# EAGLE design teensy_adapter (EAGLE 9.3.2)
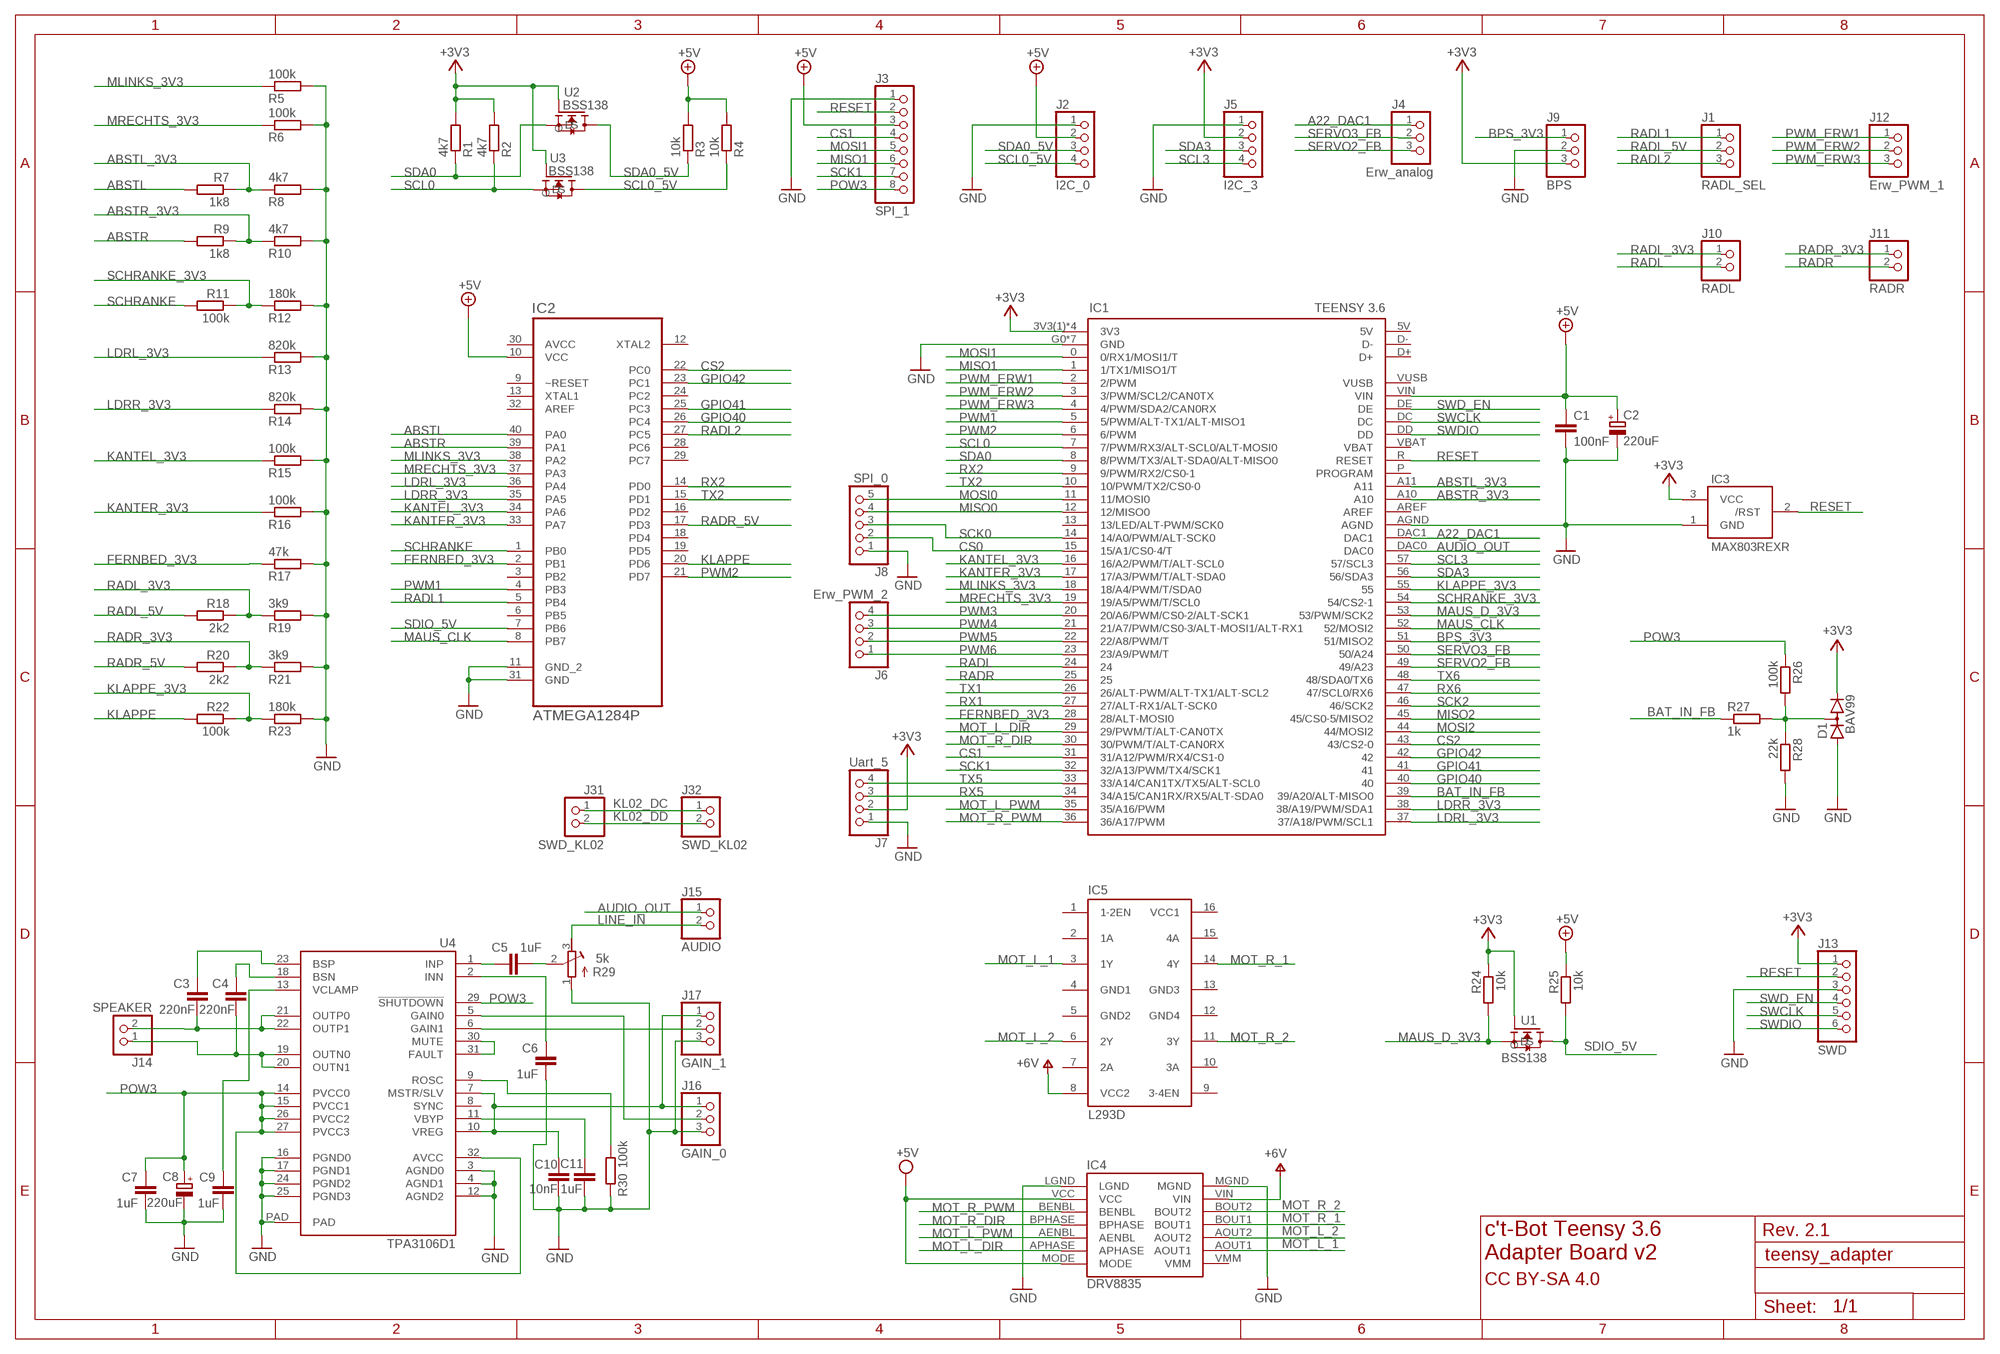
[diagram p0: schematic, sheet 1]

## Parts
C1  100nF  C-EU025-025X050  [C025-025X050]
C2  220uF  CPOL-EUE2.5-6  [E2,5-6]
C3  220nF  C-EU025-025X050  [C025-025X050]
C4  220nF  C-EU025-025X050  [C025-025X050]
C5  1uF  C-EU025-025X050  [C025-025X050]
C6  1uF  C-EU025-025X050  [C025-025X050]
C7  1uF  C-EU025-025X050  [C025-025X050]
C8  220uF  CPOL-EUE2.5-6  [E2,5-6]
C9  1uF  C-EU025-025X050  [C025-025X050]
C10  10nF  C-EU025-025X050  [C025-025X050]
C11  1uF  C-EU025-025X050  [C025-025X050]
D1  BAV99  BAV199  [SOT23]
IC1  TEENSY 3.6  TEENSY3_6--ALLPINS  [T36]
IC2  ATMEGA1284P  ATMEGA1284P-PU  [DIP254P1524X483-40]
IC3  MAX803REXR  [SC70-3L]
IC4  DRV8835  POLOLU_MOTOR_DRV8835THROUGHHOLE  [POLOLU_MOTOR_DRV_DRV8835]
IC5  L293D  [DIL16]
J1  RADL_SEL  PINHD-1X3  [1X03]
J2  I2C_0  PINHD-1X4  [1X04]
J3  SPI_1  PINHD-1X8  [1X08]
J4  Erw_analog  PINHD-1X3  [1X03]
J5  I2C_3  PINHD-1X4  [1X04]
J6  Erw_PWM_2  PINHD-1X4  [1X04]
J7  Uart_5  PINHD-1X4  [1X04]
J8  SPI_0  PINHD-1X5  [1X05]
J9  BPS  PINHD-1X3  [1X03]
J10  RADL  PINHD-1X2  [1X02]
J11  RADR  PINHD-1X2  [1X02]
J12  Erw_PWM_1  PINHD-1X3  [1X03]
J13  SWD  PINHD-1X6  [1X06]
J14  SPEAKER  PINHD-1X2  [1X02]
J15  AUDIO  PINHD-1X2  [1X02]
J16  GAIN_0  PINHD-1X3  [1X03]
J17  GAIN_1  PINHD-1X3  [1X03]
J31  SWD_KL02  PINHD-1X2  [1X02]
J32  SWD_KL02  PINHD-1X2/90  [1X02/90]
R1  4k7  R-EU_0204/2V  [0204V]
R2  4k7  R-EU_0204/2V  [0204V]
R3  10k  R-EU_0204/2V  [0204V]
R4  10k  R-EU_0204/2V  [0204V]
R5  100k  R-EU_0204/2V  [0204V]
R6  100k  R-EU_0204/2V  [0204V]
R7  1k8  R-EU_0204/2V  [0204V]
R8  4k7  R-EU_0204/2V  [0204V]
R9  1k8  R-EU_0204/2V  [0204V]
R10  4k7  R-EU_0204/2V  [0204V]
R11  100k  R-EU_0204/2V  [0204V]
R12  180k  R-EU_0204/2V  [0204V]
R13  820k  R-EU_0204/2V  [0204V]
R14  820k  R-EU_0204/2V  [0204V]
R15  100k  R-EU_0204/2V  [0204V]
R16  100k  R-EU_0204/2V  [0204V]
R17  47k  R-EU_0204/2V  [0204V]
R18  2k2  R-EU_0204/2V  [0204V]
R19  3k9  R-EU_0204/2V  [0204V]
R20  2k2  R-EU_0204/2V  [0204V]
R21  3k9  R-EU_0204/2V  [0204V]
R22  100k  R-EU_0204/2V  [0204V]
R23  180k  R-EU_0204/2V  [0204V]
R24  10k  R-EU_0204/2V  [0204V]
R25  10k  R-EU_0204/2V  [0204V]
R26  100k  R-EU_0204/2V  [0204V]
R27  1k  R-EU_0204/2V  [0204V]
R28  22k  R-EU_0204/2V  [0204V]
R29  5k  R-TRIMM64W  [RTRIM64W]
R30  100k  R-EU_0204/2V  [0204V]
U1  BSS138  [BSS138]
U2  BSS138  [BSS138]
U3  BSS138  [BSS138]
U4  TPA3106D1  [HTQFP32]

## Nets
+3V3: D1.2(C) IC1.3V3(1)(3V3) IC1.3V3(2)(3V3) IC1.3V3(3)(3V3) IC1.3V3(4)(3V3) IC3.3(VCC) J5.2 J7.2 J9.3 J13.1 R1.2 R2.2 R24.1 U1.G U2.G U3.G
+5V: C1.1 C2.+ IC1.VIN IC2.10(VCC) IC4.MODE IC4.VCC J2.2 J3.3 R3.2 R4.2 R25.1
+6V: IC4.VIN IC5.8(VCC2)
A22_DAC1: IC1.DAC1 J4.1
ABSTL: IC2.40(PA0) R7.2
ABSTL_3V3: IC1.A11 R7.1 R8.1
ABSTR: IC2.39(PA1) R9.2
ABSTR_3V3: IC1.A10 R9.1 R10.1
AUDIO_OUT: IC1.DAC0 J15.1
BAT_IN_FB: IC1.39(39/A20/ALT-MISO0) R27.1
BPS_3V3: IC1.51(51/MISO2) J9.1
BSN: C4.1 U4.18(BSN)
BSP: C3.1 U4.23(BSP)
CS0: IC1.15(15/A1/CS0-4/T) J8.2
CS1: IC1.31(31/A12/PWM/RX4/CS1-0) J3.4
CS2: IC1.43(43/CS2-0) IC2.22(PC0)
FERNBED_3V3: IC1.28(28/ALT-MOSI0) IC2.2(PB1) R17.1
GAIN0: J16.2 U4.5(GAIN0)
GAIN1: J17.2 U4.6(GAIN1)
GND: C1.2 C2.- C6.2 C7.2 C8.- C9.2 C10.2 C11.2 D1.1(A) IC1.AGND IC1.G0(GND) IC1.G1(GND) IC1.G2(GND) IC1.G3(GND) IC1.G4(GND) IC1.G5(GND) IC1.G6(GND) IC2.11(GND_2) IC2.31(GND) IC3.1(GND) IC4.LGND IC4.MGND J2.1 J3.1 J5.1 J7.1 J8.1 J9.2 J13.3 J16.3 J17.3 R5.2 R6.2 R8.2 R10.2 R12.2 R13.2 R14.2 R15.2 R16.2 R17.2 R19.2 R21.2 R23.2 R28.2 R29.1(E) R30.1 U4.3(AGND0) U4.4(AGND1) U4.12(AGND2) U4.16(PGND0) U4.17(PGND1) U4.24(PGND2) U4.25(PGND3) U4.PAD
GPIO40: IC1.40 IC2.26(PC4)
GPIO41: IC1.41 IC2.25(PC3)
GPIO42: IC1.42 IC2.23(PC1)
INN: C6.1 U4.2(INN)
INP: C5.1 U4.1(INP)
KANTEL_3V3: IC1.16(16/A2/PWM/T/ALT-SCL0) IC2.34(PA6) R15.1
KANTER_3V3: IC1.17(17/A3/PWM/T/ALT-SDA0) IC2.33(PA7) R16.1
KL02_DC: J31.1 J32.1
KL02_DD: J31.2 J32.2
KLAPPE: IC2.20(PD6) R22.2
KLAPPE_3V3: IC1.55 R22.1 R23.1
LDRL_3V3: IC1.37(37/A18/PWM/SCL1) IC2.36(PA4) R13.1
LDRR_3V3: IC1.38(38/A19/PWM/SDA1) IC2.35(PA5) R14.1
LINE_IN: J15.2 R29.3(A)
MAUS_CLK: IC1.52(52/MOSI2) IC2.8(PB7)
MAUS_D_3V3: IC1.53(53/PWM/SCK2) R24.2 U1.S
MISO0: IC1.12(12/MISO0) J8.4
MISO1: IC1.1(1/TX1/MISO1/T) J3.6
MISO2: IC1.45(45/CS0-5/MISO2)
MLINKS_3V3: IC1.18(18/A4/PWM/T/SDA0) IC2.38(PA2) R5.1
MOSI0: IC1.11(11/MOSI0) J8.5
MOSI1: IC1.0(0/RX1/MOSI1/T) J3.5
MOSI2: IC1.44(44/MOSI2)
MOT_L_1: IC4.AOUT1 IC5.3(1Y)
MOT_L_2: IC4.AOUT2 IC5.6(2Y)
MOT_L_DIR: IC1.29(29/PWM/T/ALT-CAN0TX) IC4.APHASE
MOT_L_PWM: IC1.35(35/A16/PWM) IC4.AENBL
MOT_R_1: IC4.BOUT1 IC5.14(4Y)
MOT_R_2: IC4.BOUT2 IC5.11(3Y)
MOT_R_DIR: IC1.30(30/PWM/T/ALT-CAN0RX) IC4.BPHASE
MOT_R_PWM: IC1.36(36/A17/PWM) IC4.BENBL
MRECHTS_3V3: IC1.19(19/A5/PWM/T/SCL0) IC2.37(PA3) R6.1
N$4: D1.3(AC) R26.2 R27.2 R28.1
N$90: U4.30(MUTE) U4.31(FAULT)
N$163: C5.2 R29.2(S)
OUTN: C4.2 J14.1 U4.19(OUTN0) U4.20(OUTN1)
OUTP: C3.2 J14.2 U4.21(OUTP0) U4.22(OUTP1)
POW3: C7.1 C8.+ J3.8 R26.1 U4.14(PVCC0) U4.15(PVCC1) U4.26(PVCC2) U4.27(PVCC3) U4.29(!SHUTDOWN) U4.32(AVCC)
PWM1: IC1.5(5/PWM/ALT-TX1/ALT-MISO1) IC2.4(PB3)
PWM2: IC1.6(6/PWM) IC2.21(PD7)
PWM3: IC1.20(20/A6/PWM/CS0-2/ALT-SCK1) J6.4
PWM4: IC1.21(21/A7/PWM/CS0-3/ALT-MOSI1/ALT-RX1) J6.3
PWM5: IC1.22(22/A8/PWM/T) J6.2
PWM6: IC1.23(23/A9/PWM/T) J6.1
PWM_ERW1: IC1.2(2/PWM) J12.1
PWM_ERW2: IC1.3(3/PWM/SCL2/CAN0TX) J12.2
PWM_ERW3: IC1.4(4/PWM/SDA2/CAN0RX) J12.3
RADL: IC1.24 J10.2
RADL1: IC2.5(PB4) J1.1
RADL2: IC2.27(PC5) J1.3
RADL_3V3: J10.1 R18.1 R19.1
RADL_5V: J1.2 R18.2
RADR: IC1.25 J11.2
RADR_3V3: J11.1 R20.1 R21.1
RADR_5V: IC2.17(PD3) R20.2
RESET: IC1.R(RESET) IC3.2(/RST) J3.2 J13.2
ROSC: R30.2 U4.9(ROSC)
RX1: IC1.27(27/ALT-RX1/ALT-SCK0)
RX2: IC1.9(9/PWM/RX2/CS0-1) IC2.14(PD0)
RX5: IC1.34(34/A15/CAN1RX/RX5/ALT-SDA0) J7.3
RX6: IC1.47(47/SCL0/RX6)
SCHRANKE: IC2.1(PB0) R11.2
SCHRANKE_3V3: IC1.54(54/CS2-1) R11.1 R12.1
SCK0: IC1.14(14/A0/PWM/ALT-SCK0) J8.3
SCK1: IC1.32(32/A13/PWM/TX4/SCK1) J3.7
SCK2: IC1.46(46/SCK2)
SCL0: IC1.7(7/PWM/RX3/ALT-SCL0/ALT-MOSI0) R2.1 U3.S
SCL0_5V: J2.4 R4.1 U3.D
SCL3: IC1.57(57/SCL3) J5.4
SDA0: IC1.8(8/PWM/TX3/ALT-SDA0/ALT-MISO0) R1.1 U2.S
SDA0_5V: J2.3 R3.1 U2.D
SDA3: IC1.56(56/SDA3) J5.3
SDIO_5V: IC2.7(PB6) R25.2 U1.D
SERVO2_FB: IC1.49(49/A23) J4.3
SERVO3_FB: IC1.50(50/A24) J4.2
SWCLK: IC1.DC J13.5
SWD_EN: IC1.DE J13.4
SWDIO: IC1.DD J13.6
TX1: IC1.26(26/ALT-PWM/ALT-TX1/ALT-SCL2)
TX2: IC1.10(10/PWM/TX2/CS0-0) IC2.15(PD1)
TX5: IC1.33(33/A14/CAN1TX/TX5/ALT-SCL0) J7.4
TX6: IC1.48(48/SDA0/TX6)
VBYP: C11.1 U4.11(VBYP)
VCLAMP: C9.1 U4.13(VCLAMP)
VREG: C10.1 J16.1 J17.1 U4.7(MSTR/SLV) U4.10(VREG)
Unconnected: IC1.5V IC1.13(13/LED/ALT-PWM/SCK0) IC1.AREF IC1.D+ IC1.D- IC1.P(PROGRAM) IC1.VBAT IC1.VUSB IC2.3(PB2) IC2.6(PB5) IC2.9(~RESET) IC2.12(XTAL2) IC2.13(XTAL1) IC2.16(PD2) IC2.18(PD4) IC2.19(PD5) IC2.24(PC2) IC2.28(PC6) IC2.29(PC7) IC2.32(AREF) IC4.VMM IC5.1(1-2EN) IC5.2(1A) IC5.7(2A) IC5.9(3-4EN) IC5.10(3A) IC5.15(4A) U4.8(SYNC)

## Notes on the sheet
- Rev. 2.1
- c't-Bot Teensy 3.6 
  Adapter Board v2
- CC BY-SA 4.0

## Power pins joined to a net without a drawn wire
AVCC: IC2.30(AVCC)
GND1: IC5.4(GND1)
GND2: IC5.5(GND2)
GND3: IC5.13(GND3)
GND4: IC5.12(GND4)
VCC1: IC5.16(VCC1)

## Library data of the parts
C1 = rcl:C-EU: CAPACITOR, European symbol; SPICEPREFIX: C
C2 = rcl:CPOL-EU: POLARIZED CAPACITOR, European symbol; SPICEPREFIX: C
C3-C7 C9-C11 = rcl:C-EU: CAPACITOR, European symbol
C8 = rcl:CPOL-EU: POLARIZED CAPACITOR, European symbol
D1 = diode:BAV199: DIODE low-leakage double diode
IC1 = Teensy_3_6:TEENSY3_6--ALLPINS
IC2 = Atmel_By_element14_Batch_1:ATMEGA1284P-PU: 8-bit Microcontroller with In-System Programmable Flash; MPN: ATMEGA1284P-PU; OC_FARNELL: 1715481; OC_NEWARK: 15R0264; PACKAGE: PDIP-40; SUPPLIER: Atmel
IC3 = maxim-10:MAX803*: 3-Pin Microprocessor Reset Circuit
IC4 = pololu:POLOLU_MOTOR_DRV8835
IC5 = st-microelectronics:L293D: PUSH-PULL 4 CHANNEL DRIVER; MPN: L293D; OC_FARNELL: 9589619; OC_NEWARK: 56P8249
J1 J4 J9 J12 J16 J17 = pinhead_ts:PINHD-1X3: PIN HEADER
J2 J5-J7 = pinhead_ts:PINHD-1X4: PIN HEADER
J3 = pinhead_ts:PINHD-1X8: PIN HEADER
J8 = pinhead_ts:PINHD-1X5: PIN HEADER
J10 J11 J14 J15 J31 J32 = pinhead_ts:PINHD-1X2: PIN HEADER
J13 = pinhead_ts:PINHD-1X6: PIN HEADER
R1-R28 = rcl:R-EU_: RESISTOR, European symbol; SPICEPREFIX: R
R29 = rcl:R-TRIMM: Trimm resistor
R30 = rcl:R-EU_: RESISTOR, European symbol
U1-U3 = Ava:BSS138: BSS138 N-Channel Logic Level Enhancement Mode Field Effect Transistor
U4 = user:TPA3106D1

## Net classes
0 default: width 0.203 mm

## Board
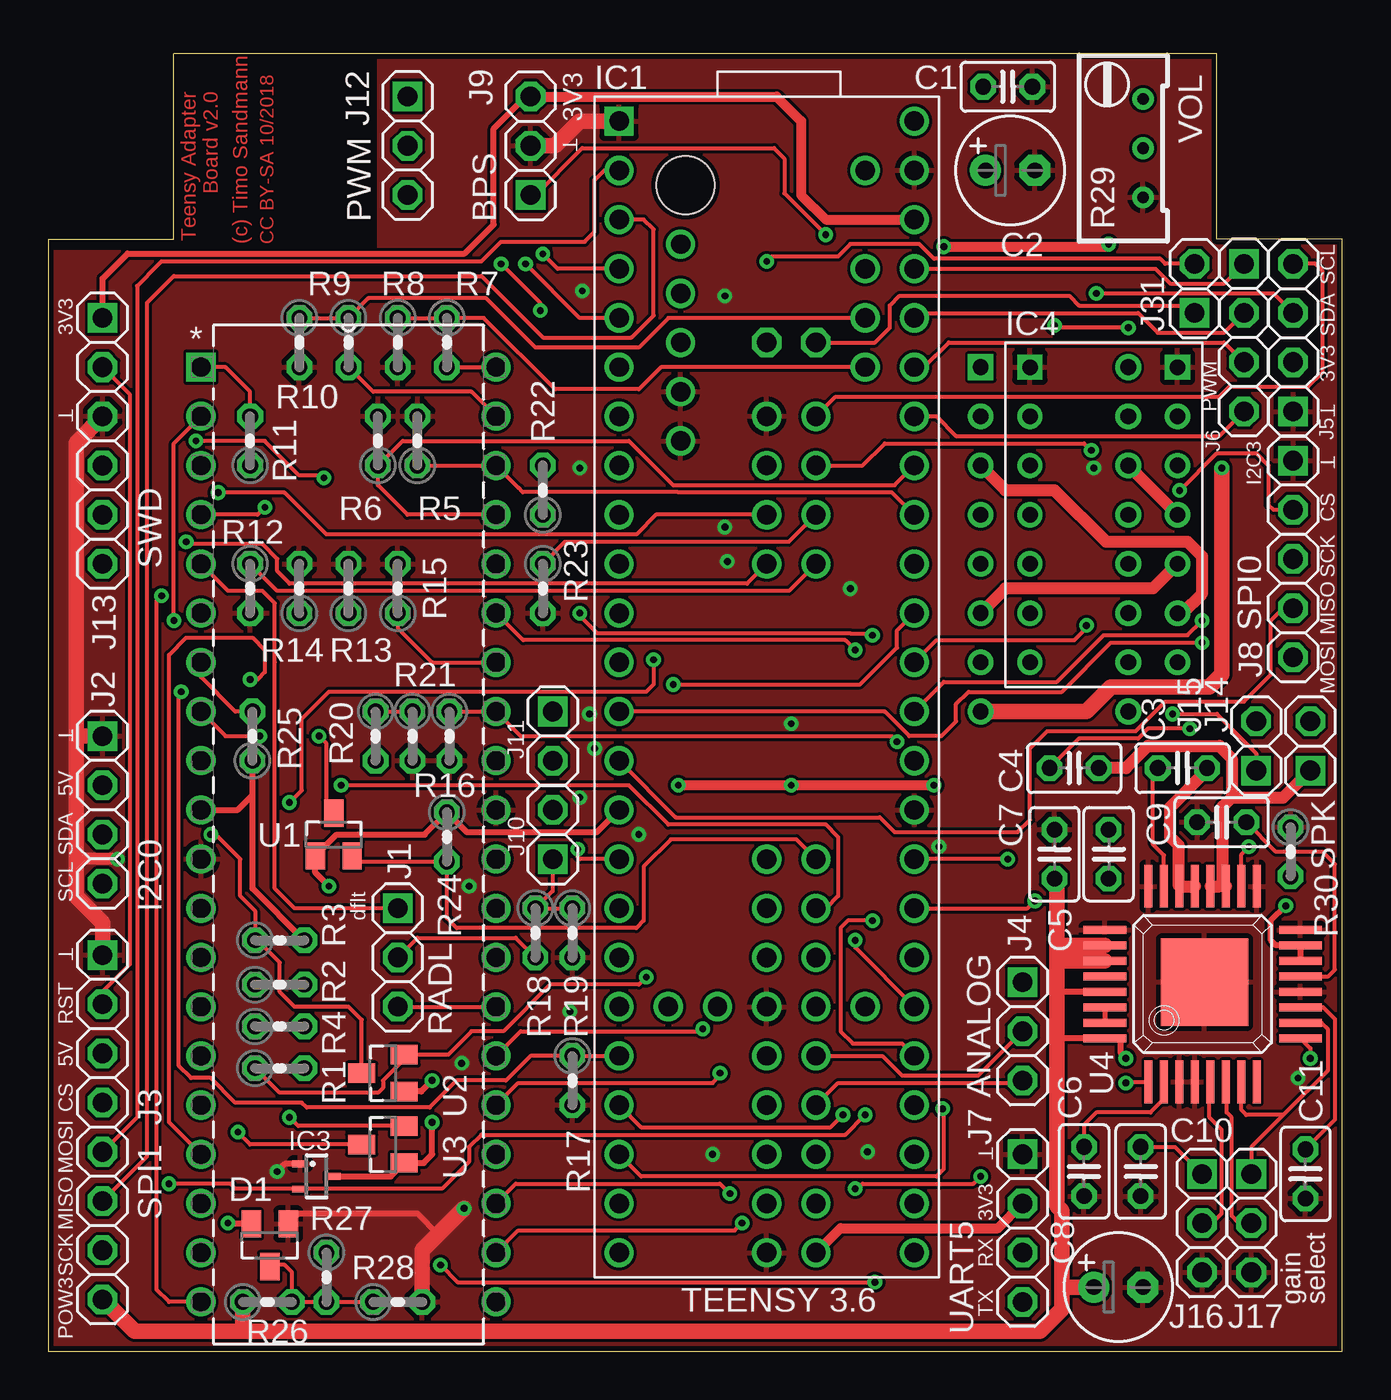
[diagram p1: board, top side]
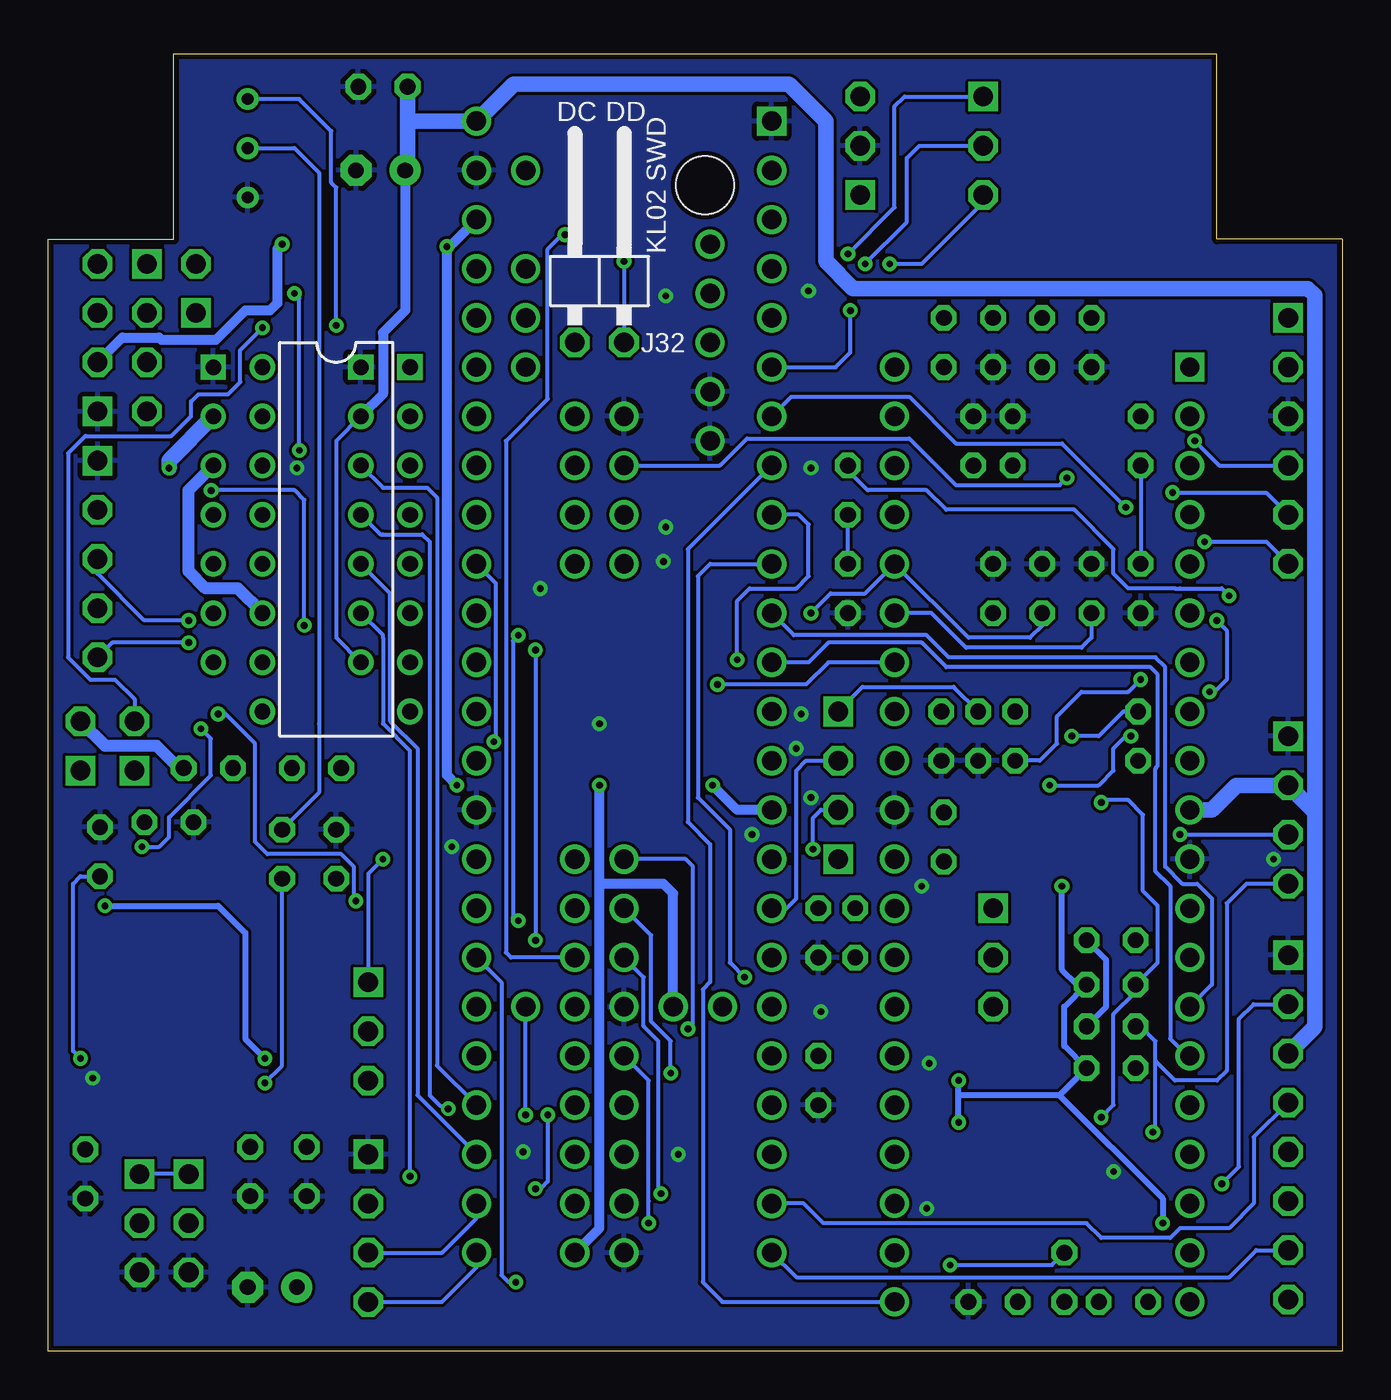
[diagram p2: board, bottom side, seen from below]

Size 66.8 x 66.98 mm. Coordinates in mm from the lower left corner, seen from the top.
Outline: 0,0 66.8,0 66.8,57.4 60.33,57.4 60.33,66.98 6.48,66.98 6.48,57.4 0,57.4 0,0
Copper layers (1*16): Top 0.035mm / dielectric 1.5mm / Bottom 0.035mm
Design rules "jlcpcb_2layer_DRU": minimum track width 6mil, minimum drill 0.3mm, track to track 6mil, track to pad 6mil, pad to pad 6mil, via to via 6mil, smd to smd 6mil, copper to edge 10mil, drill to drill 6mil, minimum pad ring 10mil, minimum via ring 8mil, stop-mask expansion 4mil, vias tented up to drill 0mil, thermal gap 10mil
Holes 3 mm at 32.89,60.2

### Footprints (pad centres in the part's own frame; a part is rotated, then mirrored left to right if it is on the bottom)
C025-025X050 = drill 0.813 octagon: 1 -1.27,0; 2 1.27,0
E2,5-6 = drill 0.813 pad 1.6: + -1.27,0 | drill 0.813 pad 1.6 octagon: - 1.27,0
SOT23 = smd 1 x 1.4: 1 -0.95,-1.1; 2 0.95,-1.1; 3 0,1.1
T36 = drill 1: 0 -26.67,-7.62; 1 -24.13,-7.62; 2 -21.59,-7.62; 3 -19.05,-7.62; 3V3(1) 6.35,-7.62; 3V3(2) 16.51,-2.54; 3V3(3) -24.13,7.62; 3V3(4) 29.21,2.54; 4 -16.51,-7.62; 5 -13.97,-7.62; 5V -22.86,-4.445; 6 -11.43,-7.62; 7 -8.89,-7.62; 8 -6.35,-7.62; 9 -3.81,-7.62; 10 -1.27,-7.62; 11 1.27,-7.62; 12 3.81,-7.62; 13 3.81,7.62; 14 1.27,7.62; 15 -1.27,7.62; 16 -3.81,7.62; 17 -6.35,7.62; 18 -8.89,7.62; 19 -11.43,7.62; 20 -13.97,7.62; 21 -16.51,7.62; 22 -19.05,7.62; 23 -21.59,7.62; 24 8.89,-7.62; 25 11.43,-7.62; 26 13.97,-7.62; 27 16.51,-7.62; 28 19.05,-7.62; 29 21.59,-7.62; 30 24.13,-7.62; 31 26.67,-7.62; 32 29.21,-7.62; 33 29.21,7.62; 34 26.67,7.62; 35 24.13,7.62; 36 21.59,7.62; 37 19.05,7.62; 38 16.51,7.62; 39 13.97,7.62; 40 8.89,0; 41 11.43,0; 42 13.97,0; 43 19.05,0; 44 21.59,0; 45 24.13,0; 46 26.67,0; 47 26.67,2.54; 48 24.13,2.54; 49 21.59,2.54; 50 19.05,2.54; 51 13.97,2.54; 52 11.43,2.54; 53 8.89,2.54; 54 -6.35,2.54; 55 -8.89,2.54; 56 -11.43,2.54; 57 -13.97,2.54; A10 -19.05,5.08; A11 -16.51,5.08; AGND -26.67,7.62; AREF -21.59,5.08; D+ -17.78,-4.445; D- -20.32,-4.445; DAC0 11.43,7.62; DAC1 8.89,7.62; DC -8.89,0; DD -6.35,0; DE -11.43,0; G1 16.51,0; G2 6.35,7.62; G3 29.21,0; G4 -15.24,-4.445; G5 -12.7,-4.445; G6 -13.97,0; P 16.51,2.54; R 16.51,5.08; VBAT 16.51,-5.08; VIN -29.21,7.62; VUSB -26.67,5.08 | drill 1 square: G0 -29.21,-7.62
DIP254P1524X483-40 = drill 0.991 square: 1 -15.24,48.26 | drill 0.991: 2 -15.24,45.72; 3 -15.24,43.18; 4 -15.24,40.64; 5 -15.24,38.1; 6 -15.24,35.56; 7 -15.24,33.02; 8 -15.24,30.48; 9 -15.24,27.94; 10 -15.24,25.4; 11 -15.24,22.86; 12 -15.24,20.32; 13 -15.24,17.78; 14 -15.24,15.24; 15 -15.24,12.7; 16 -15.24,10.16; 17 -15.24,7.62; 18 -15.24,5.08; 19 -15.24,2.54; 20 -15.24,0; 21 0,0; 22 0,2.54; 23 0,5.08; 24 0,7.62; 25 0,10.16; 26 0,12.7; 27 0,15.24; 28 0,17.78; 29 0,20.32; 30 0,22.86; 31 0,25.4; 32 0,27.94; 33 0,30.48; 34 0,33.02; 35 0,35.56; 36 0,38.1; 37 0,40.64; 38 0,43.18; 39 0,45.72; 40 0,48.26
SC70-3L = smd 0.35 x 0.8: 1 -0.65,-0.85; 2 0.65,-0.85; 3 0,0.85
POLOLU_MOTOR_DRV_DRV8835 = drill 0.8: AENBL 1.27,6.35; AOUT1 8.89,3.81; AOUT2 8.89,6.35; APHASE 1.27,3.81; BENBL 1.27,11.43; BOUT1 8.89,8.89; BOUT2 8.89,11.43; BPHASE 1.27,8.89; MODE 1.27,1.27; VCC 1.27,13.97; VIN 8.89,13.97; VMM 8.89,1.27 | drill 0.8 square: LGND 1.27,16.51; MGND 8.89,16.51
DIL16 = drill 0.813 square: 1 -8.89,-3.81 | drill 0.813: 2 -6.35,-3.81; 3 -3.81,-3.81; 4 -1.27,-3.81; 5 1.27,-3.81; 6 3.81,-3.81; 7 6.35,-3.81; 8 8.89,-3.81; 9 8.89,3.81; 10 6.35,3.81; 11 3.81,3.81; 12 1.27,3.81; 13 -1.27,3.81; 14 -3.81,3.81; 15 -6.35,3.81; 16 -8.89,3.81
1X03 = drill 1.016 square: 1 -2.54,0 | drill 1.016 octagon: 2 0,0; 3 2.54,0
1X04 = drill 1.016 square: 1 -3.81,0 | drill 1.016 octagon: 2 -1.27,0; 3 1.27,0; 4 3.81,0
1X08 = drill 1.016 square: 1 -8.89,0 | drill 1.016 octagon: 2 -6.35,0; 3 -3.81,0; 4 -1.27,0; 5 1.27,0; 6 3.81,0; 7 6.35,0; 8 8.89,0
1X05 = drill 1.016 square: 1 -5.08,0 | drill 1.016 octagon: 2 -2.54,0; 3 0,0; 4 2.54,0; 5 5.08,0
1X02 = drill 1.016 square: 1 -1.27,0 | drill 1.016 octagon: 2 1.27,0
1X06 = drill 1.016 square: 1 -6.35,0 | drill 1.016 octagon: 2 -3.81,0; 3 -1.27,0; 4 1.27,0; 5 3.81,0; 6 6.35,0
1X02/90 = drill 1.016 octagon: 1 -1.27,-3.81; 2 1.27,-3.81
0204V = drill 0.813 octagon: 1 -1.27,0; 2 1.27,0
RTRIM64W = drill 0.61: 1 1.27,-2.54; 2 1.27,0; 3 1.27,2.54
BSS138 = smd 1 x 1.4: D 0,1.1; G -0.95,-1.1; S 0.95,-1.1
HTQFP32 = smd 0.4 x 2.2: 1 -2.9,-5.15; 2 -2.1,-5.15; 3 -1.3,-5.15; 4 -0.5,-5.15; 5 0.3,-5.15; 6 1.1,-5.15; 7 1.9,-5.15; 8 2.7,-5.15; 17 2.7,4.95; 18 1.9,4.95; 19 1.1,4.95; 20 0.3,4.95; 21 -0.5,4.95; 22 -1.3,4.95; 23 -2.1,4.95; 24 -2.9,4.95 | smd 2.2 x 0.4: 9 4.95,-2.9; 10 4.95,-2.1; 11 4.95,-1.3; 12 4.95,-0.5; 13 4.95,0.3; 14 4.95,1.1; 15 4.95,1.9; 16 4.95,2.7; 25 -5.15,2.7; 26 -5.15,1.9; 27 -5.15,1.1; 28 -5.15,0.3; 29 -5.15,-0.5; 30 -5.15,-1.3; 31 -5.15,-2.1; 32 -5.15,-2.9 | smd 4.5 x 4.5: PAD 0,0

### Placement (x,y rotation side)
C1  49.53,65.28 0 top
C2  49.66,60.96 0 top
C3  220n  [C025-025X050]  58.55,30.1 0 top
C4  220n  [C025-025X050]  52.96,30.1 0 top
C5  1u  [C025-025X050]  54.74,25.65 90 top
C6  1u  [C025-025X050]  53.47,9.27 270 top
C7  1u  [C025-025X050]  51.94,25.65 90 top
C8  220u  [E2,5-6]  55.24,3.3 0 top
C9  1u  [C025-025X050]  60.58,27.3 180 top
C10  10n  [C025-025X050]  56.39,9.27 270 top
C11  1u  [C025-025X050]  64.9,9.14 270 top
D1  11.43,5.46 180 top
IC1  37.08,34.29 270 top
IC2  23.11,2.54 0 top
IC3  13.84,9.02 270 top
IC4  49.4,34.29 0 top
IC5  51.94,41.91 270 top
J1  RADL  [1X03]  18.03,20.32 270 top
J2  2.79,27.94 270 top
J3  2.79,11.56 270 top
J4  50.29,16.51 270 top
J5  64.26,52.32 90 top
J6  61.72,52.32 270 top
J7  50.29,6.35 270 top
J8  64.26,40.89 270 top
J9  24.89,62.23 90 top
J10  26.04,26.67 90 top
J11  26.04,31.75 270 top
J12  18.54,62.23 270 top
J13  2.79,46.99 270 top
J14  65.15,31.24 90 top
J15  62.36,31.24 90 top
J16  59.56,6.6 270 top
J17  62.1,6.6 270 top
J31  59.18,54.86 90 top
J32  38.35,55.88 0 bottom
R1  11.94,14.61 0 top
R2  11.94,18.92 0 top
R3  11.94,21.21 0 top
R4  11.94,16.76 0 top
R5  19.05,46.99 90 top
R6  17.02,46.99 90 top
R7  20.57,52.07 270 top
R8  18.03,52.07 270 top
R9  15.49,52.07 270 top
R10  12.95,52.07 270 top
R11  10.41,46.99 90 top
R12  10.41,39.37 270 top
R13  15.49,39.37 90 top
R14  12.95,39.37 90 top
R15  18.03,39.37 90 top
R16  20.7,31.75 270 top
R17  27.05,13.97 270 top
R18  25.15,21.59 270 top
R19  27.05,21.59 270 top
R20  16.89,31.75 270 top
R21  18.8,31.75 270 top
R22  25.53,44.45 90 top
R23  25.53,39.37 270 top
R24  20.57,26.54 270 top
R25  10.54,31.75 90 top
R26  11.3,2.54 0 top
R27  14.35,3.81 270 top
R28  18.03,2.54 0 top
R29  5K  [RTRIM64W]  55.24,62.1 0 top
R30  100K  [0204V]  64.14,25.78 270 top
U1  14.73,26.67 0 top
U2  17.27,14.35 90 top
U3  17.27,10.67 90 top
U4  59.69,19.05 0 top

### Tracks (layer width: path | path; a pad name or v marks a point on that pad's centre or on a via)
+3V3  (via drill 0.35)
  Top 0.305: IC1.3V3(1) 28.32,26.8 21.59,26.8 R24.1 19.43,26.67 14.88,26.67 U1.G 13.78,24.7 v14.48,24 | v19.81,11.81 19.81,10.16 19.37,9.72 U3.G 17.67,9.02 IC3.3 | v19.81,13.97 19.24,13.4 U2.G | D1.2 9.31,6.56 v9.27,6.6 | J13.1 2.79,55.37 4.09,56.67 21.49,56.67 22.99,58.17 22.99,63.12 24.64,64.77 J9.3
  Top 0.508: J9.3 37.59,64.77 38.86,63.5 38.86,59.69 40.13,58.42 IC1.3V3(3) | v46.23,57.02 54.61,57.02 v54.74,57.15 | IC1.3V3(4) 40.89,6.35 49.02,6.35 J7.2 | v45.72,29.21 v38.35,29.21 v32.51,29.21
  Bottom 0.305: v14.48,24 14.48,19.68 13.72,18.92 R2.2 14.35,17.78 14.35,15.75 R1.2 14.61,13.21 | v19.81,11.81 19.81,13.21 | 19.81,13.21 v19.81,13.97 | 14.61,13.21 19.81,13.21 | v9.27,6.6 9.27,7.87 14.61,13.21
  Bottom 0.508: IC1.3V3(1) 31.24,27.94 v32.51,29.21 | IC1.3V3(4) 38.35,6.35 38.35,24.13 | IC1.3V3(2) 34.54,23.62 35.05,24.13 38.35,24.13 | v45.72,29.21 46.23,29.72 46.23,56.9 46.1,57.02 | 46.1,57.02 IC1.3V3(3) | v46.23,57.02 46.1,57.02 | 38.35,24.13 v38.35,29.21 | v54.74,57.15 54.99,56.9 54.99,54.1 55.37,53.72 56.64,53.72 58.17,52.2 60.96,52.2 61.09,52.32 62.99,52.32 J5.2
+5V
  Top 0.305: IC2.10 9.78,27.94 10.54,28.7 | 10.54,28.7 R25.1 | R3.2 10.54,23.88 10.54,28.7
  Bottom 0.203: IC4.VCC 51.94,46.99 51.94,36.83 IC4.MODE
  Bottom 0.305: R4.2 12.19,17.78 12.19,20.19 R3.2
  Bottom 0.508: C2.+ 48.39,53.72 49.53,52.58 49.53,49.4 IC4.VCC
  Bottom 0.813: IC2.10 6.73,27.94 5.46,29.21 J2.2 1.42,27.84 | 48.26,63.5 IC1.VIN 42.8,65.41 28.57,65.41 26.67,63.5 26.67,56.26 25.27,54.86 1.78,54.86 1.42,54.51 1.42,27.84 | C2.+ 48.26,61.09 48.26,63.5 | 48.26,63.5 C1.1 | J3.3 1.42,16.74 1.42,27.84
+6V  (via drill 0.35)
  Top 0.813: IC5.8 53.59,33.02 54.86,34.29 59.94,34.29 60.58,34.92 v60.58,45.59
  Bottom 0.813: IC4.VIN 60.58,45.97 v60.58,45.59
A22_DAC1  (via drill 0.35)
  Top 0.203: v49.53,25.4 IC1.DAC1
  Bottom 0.203: v49.53,25.4 50.29,24.64 J4.1
ABSTL
  Top 0.203: R7.2 IC2.40
ABSTL_3V3
  Top 0.203: R8.1 R7.1 22.48,53.34 26.16,49.66 30.48,49.66 31.62,50.8 IC1.A11
ABSTR
  Top 0.203: IC2.39 21.84,49.53 16.76,49.53 R9.2
ABSTR_3V3
  Top 0.203: IC1.A10 32,53.34 30.48,51.82 25.15,51.82 22.61,54.36 16.51,54.36 R9.1 R10.1
AUDIO_OUT  (via drill 0.35)
  Top 0.203: IC1.DAC0 50.55,22.86 v50.93,23.24 | v58.04,32.89 60.33,32.89 62.36,30.86 J15.1
  Bottom 0.203: v50.93,23.24 51.03,23.34 51.03,24.99 51.69,25.65 55.5,25.65 56.13,26.29 56.13,31.37 57.66,32.89 v58.04,32.89
BAT_IN_FB  (via drill 0.35)
  Top 0.203: v20.24,4.45 21.13,3.56 v42.67,3.56
  Bottom 0.203: v20.24,4.45 14.99,4.45 R27.1 | IC1.39 43.42,19.04 43.42,3.92 43.05,3.56 v42.67,3.56
BPS_3V3  (via drill 0.35)
  Top 0.203: J9.1 25.15,59.69 27.56,62.1 37.47,62.1 38,61.57 38,59.77 v40.13,57.63
  Bottom 0.203: IC1.51 42.93,20.32 43.18,20.57 43.18,46.99 41.02,49.15 41.02,56.9 40.28,57.63 v40.13,57.63
BSN  (via drill 0.35)
  Top 0.203: U4.18 61.59,25.65 v61.98,26.04 | C4.1 53.21,31.62 56.26,31.62 56.77,32.13 v58.93,32.13
  Bottom 0.203: v61.98,26.04 61.09,26.04 60.58,26.54 60.58,27.56 58.42,29.72 58.42,31.62 v58.93,32.13
BSP
  Top 0.203: U4.23 57.59,25.59 57.02,26.16 57.02,29.84 C3.1
CS0  (via drill 0.35)
  Top 0.203: IC1.15 45.85,36.7 52.96,36.7 53.59,37.34 v53.59,37.47 | v58.4,44.43 60.33,46.35 62.36,46.35 62.99,45.72 62.99,43.69 63.25,43.43 J8.2
  Bottom 0.203: v53.59,37.47 53.59,43.94 54.1,44.45 58.29,44.45 58.38,44.45 v58.4,44.43
CS1
  Bottom 0.203: IC1.31 27.81,7.62 26.8,6.6 13.21,6.6 12.45,5.84 8.89,5.84 8.38,6.35 5.84,6.35 4.57,7.62 4.57,11.05 J3.4
CS2  (via drill 0.35)
  Top 0.203: IC2.22 24.26,6.22 35.43,6.22 v35.81,6.6
  Bottom 0.203: IC1.43 35.81,13.97 35.81,7.75 v35.81,6.6
FERNBED_3V3  (via drill 0.35)
  Top 0.203: IC1.28 R17.1 24.89,15.24 23.62,13.97 21.08,13.97 19.68,12.57 13.34,12.57 13.08,12.83 9.65,12.83 8.38,14.1 7.37,14.1 6.73,14.73 6.73,33.91 v6.86,34.04 | v6.48,37.72 6.48,46.86 IC2.2
  Bottom 0.203: v6.48,37.72 5.97,37.21 5.97,34.67 6.6,34.04 v6.86,34.04
GAIN0
  Top 0.203: J16.2 60.07,6.6 60.58,7.11 60.58,11.43 59.94,12.06 59.94,13.85 U4.5
GAIN1
  Top 0.203: J17.2 61.47,6.6 61.09,6.99 61.09,12.06 60.83,12.32 60.83,13.86 U4.6
GND  (via drill 0.35, 0.35 pad 0.65)
  Top 0.305: D1.1 12.93,7.11 19.05,7.11 20.13,6.03 | IC3.1 12.21,9.67 v11.81,9.27
  Top 0.61: v3.56,25.4 1.42,25.4
  Top 0.813: J3.1 2.79,22.1 1.42,23.47 1.42,25.4 1.42,31.75 | v21.46,7.37 20.13,6.03 19.3,5.21 R28.2 | IC1.G0 27.43,63.5 26.16,62.23 J9.2 | 1.42,31.75 1.42,46.89 J13.3 | J2.1 1.42,31.75
  other vias: 45.97,26.04 41.4,39.37 35.05,40.77 34.92,42.55 27.43,45.59 27.56,54.74 42.29,10.29 34.29,10.16 26.92,17.53 30.48,26.67 53.98,45.59 38.35,32.38 21.72,24 21.34,14.86 28.19,31.11 27.94,32.89 27.43,28.57 64.52,14.1 34.92,54.48
  pour Bottom: -1.4,67.87 67.69,67.87 67.69,-1.11 -1.4,-1.28
  pour Top: 68.07,67.31 17.02,67.31 17.02,56.77 -0.51,56.77 -0.51,-1.27 68.07,-1.27
GPIO40  (via drill 0.35)
  Top 0.203: IC2.26 24.38,16.51 33.66,16.51 v33.78,16.64
  Bottom 0.203: IC1.40 33.91,25.4 33.53,25.02 33.53,16.89 v33.78,16.64
GPIO41  (via drill 0.35)
  Top 0.203: IC2.25 24.26,13.84 34.29,13.84 34.67,14.23 v34.67,14.35
  Bottom 0.203: v34.67,14.35 34.67,16 35.69,17.02 35.69,21.46 IC1.41
GPIO42  (via drill 0.35)
  Top 0.203: IC2.23 24.13,8.64 34.67,8.64 v35.18,8.13
  Bottom 0.203: IC1.42 36.07,19.3 36.07,16.76 35.31,16 35.31,8.25 v35.18,8.13
INN
  Top 0.203: U4.2 57.59,13.01 56.9,12.32 54.1,12.32 53.47,11.68 C6.1
INP  (via drill 0.35)
  Top 0.203: v55.63,13.84 55.68,13.9 U4.1
  Bottom 0.203: v55.63,13.84 54.74,14.73 C5.1
KANTEL_3V3  (via drill 0.35)
  Top 0.203: R15.1 18.03,37.34 19.81,35.56 IC2.34 | IC1.16 43.81,37.21 43.81,36.32 41.91,34.42 v32.26,34.42
  Bottom 0.203: IC2.34 26.54,35.56 27.69,34.42 v32.26,34.42
KANTER_3V3  (via drill 0.35)
  Top 0.203: R16.1 IC2.33 24.38,31.75 43.52,31.75 v43.81,31.46
  Bottom 0.203: IC1.17 43.7,39.63 43.7,31.58 v43.81,31.46
KL02_DC
  Top 0.203: J32.1 42.67,52.07 43.43,52.83 43.43,53.98 43.94,54.48 52.7,54.48 53.21,53.98 58.8,53.98 J31.1
KL02_DD  (via drill 0.35)
  Top 0.203: J31.2 57.66,56.13 57.4,56.39 45.72,56.39 44.96,57.15 41.4,57.15 40.77,56.52 37.34,56.52 v37.08,56.26
  Bottom 0.203: v37.08,56.26 J32.2
KLAPPE  (via drill 0.35)
  Top 0.203: IC2.20 6.22,2.54 5.59,3.17 5.59,38.73 v5.84,38.99
  Bottom 0.203: R22.2 25.53,45.47 24.51,44.45 21.46,44.45 20.45,43.43 13.84,43.43 11.81,41.4 11.81,40.13 11.05,39.37 8.64,39.37 8.38,39.37 6.22,39.37 v5.84,38.99
KLAPPE_3V3
  Top 0.203: R23.1 26.67,41.78 38.23,41.78 IC1.55
  Bottom 0.203: R23.1 R22.1
LDRL_3V3  (via drill 0.35)
  Top 0.203: v27.43,38.1 27.43,37.97 28.35,37.06 41.4,37.06 42.44,37.06 v42.55,36.96 | v42.55,22.23 41.27,22.23 40.89,21.84 40.89,16.51 41.53,15.88 44.07,15.88 IC1.37
  Bottom 0.203: v27.43,38.1 26.42,39.12 24.64,39.12 IC2.36 19.3,36.83 16.13,36.83 15.49,37.47 R13.1 | v42.55,36.96 42.82,36.68 42.82,22.38 42.67,22.23 v42.55,22.23
LDRR_3V3  (via drill 0.35)
  Top 0.203: IC2.35 24.51,36.7 41.15,36.7 v41.66,36.2 | v41.66,21.21 41.66,20.83 IC1.38
  Bottom 0.203: R14.1 12.95,36.83 13.46,36.32 19.43,36.32 21.21,38.1 IC2.35 | v41.66,36.2 v41.66,21.21
LINE_IN  (via drill 0.35)
  Top 0.203: v55.75,52.83 52.07,52.83 v51.94,52.96
  Bottom 0.203: J15.2 62.36,33.66 63.37,34.67 64.64,34.67 65.79,35.81 65.79,46.35 64.9,47.24 60.45,47.24 59.44,48.26 59.44,49.02 59.05,49.4 57.53,49.4 56.9,50.04 56.9,51.69 v55.75,52.83 | v51.94,52.96 51.94,60.07 52.2,60.33 52.2,62.99 53.85,64.64 R29.3
MAUS_CLK  (via drill 0.35)
  Top 0.203: IC2.8 9.14,31.75 v10.92,31.75 | IC1.52 40.13,22.86 40.77,23.5 40.77,26.54 40.13,27.18 32,27.18 29.97,29.21 v15.11,29.21
  Bottom 0.203: v15.11,29.21 12.57,29.21 11.81,29.97 11.81,31.11 11.18,31.75 v10.92,31.75
MAUS_D_3V3
  Top 0.203: U1.S 15.98,25.27 R24.2 20.57,22.35 21.08,21.84 30.35,21.84 30.73,22.23 30.73,25.02 32.13,26.42 38.61,26.42 IC1.53
MISO0
  Top 0.203: IC1.12 32.38,27.56 42.93,27.56 43.69,26.8 50.04,26.8 50.67,27.43 50.67,31.11 51.56,32 56.13,32 57.66,33.53 61.72,33.53 63.12,34.92 63.12,37.72 63.75,38.35 J8.4
MISO1
  Top 0.203: J3.6 5.08,10.03 5.08,10.79 5.08,11.56 5.08,54.1 6.48,55.5 22.35,55.5 25.53,52.32 30.1,52.32 31.24,53.47 31.24,57.91 30.73,58.42 IC1.1
MLINKS_3V3
  Top 0.203: R5.1 IC2.38 24.26,44.58 24.49,44.35 32.51,44.35 43.54,44.35 IC1.18
MOSI0  (via drill 0.35)
  Top 0.203: v59.56,36.58 54.86,36.58 52.32,34.04 47.5,34.04 46.86,33.4 46.86,32.51 46.1,31.75 44.45,31.75 43.18,33.02 IC1.11
  Bottom 0.203: v59.56,36.58 63.5,36.58 J8.5
MOSI1
  Top 0.203: J3.5 4.57,12.06 4.57,54.99 5.65,56.07 5.84,56.26 22.35,56.26 23.37,57.28 27.69,57.28 28.19,57.78 28.19,60.45 28.7,60.96 IC1.0
MOT_L_1
  Top 0.61: IC5.3 49.4,44.45 51.94,44.45 54.61,41.78 58.8,41.78 59.56,41.02 59.56,39.12 58.55,38.1 IC4.AOUT1
MOT_L_2
  Top 0.61: IC5.6 49.4,39.37 57.02,39.37 IC4.AOUT2
MOT_L_DIR  (via drill 0.35)
  Top 0.203: IC1.29 30.61,11.56 40.39,11.56 v41.02,12.19 | v41.66,8.38 41.78,8.38 42.04,8.64 47.75,8.64 v48.13,9.02
  Bottom 0.203: v41.02,12.19 41.02,8.76 41.4,8.38 v41.66,8.38 | v48.13,9.02 48.13,30.99 49.53,32.39 49.53,36.83 49.53,36.96 IC4.APHASE
MOT_L_PWM
  Bottom 0.203: IC1.35 47.75,13.21 47.75,31.11 49.15,32.51 49.15,39.12 IC4.AENBL
MOT_R_1
  Top 0.61: IC5.14 IC4.BOUT1
MOT_R_2
  Bottom 0.61: IC5.11 57.02,39.37 58.67,39.37 59.56,40.26 59.56,44.45 IC4.BOUT2
MOT_R_DIR  (via drill 0.35)
  Top 0.203: IC1.30 30.61,9.02 45.85,9.02 46.23,9.4 46.23,12.45 v46.16,12.51
  Bottom 0.203: v46.16,12.51 46.29,12.64 46.55,12.64 47.12,13.21 47.12,41.78 47.5,42.16 49.53,42.16 49.66,42.16 IC4.BPHASE
MOT_R_PWM
  Bottom 0.203: IC1.36 46.74,14.73 46.74,44.07 47.24,44.58 49.53,44.58 IC4.BENBL
MRECHTS_3V3
  Top 0.203: IC2.37 18.54,43.18 17.02,44.7 R6.1 18.29,46.99 29.97,46.99 32.26,44.7 43.69,44.7 IC1.19
N$4
  Top 0.203: D1.3 11.51,4.45 12.19,4.45 12.57,4.06 R26.2 R27.2 R28.1
N$90
  Top 0.254: U4.30 U4.31
N$163
  Bottom 0.203: R29.2 54.1,62.1 52.83,60.83 52.83,32.38 52.83,28.83 C5.2
OUTN
  Top 0.61: 60.63,24.16 60.63,28.12 61.09,28.57 | U4.20 60.47,24 60.63,24.16 | U4.19 60.63,24.16 | C4.2 55.63,30.1 56.77,31.24 60.45,31.24 61.09,30.61 61.09,28.57 | 61.09,28.57 61.59,28.57 63.75,28.57 J14.1
OUTP
  Top 0.61: U4.21 U4.22 58.35,24.04 58.35,26.11 57.91,26.54 57.91,28.07 59.82,29.97 C3.2
  Bottom 0.61: C3.2 60.07,30.1 61.21,31.24 63.88,31.24 J14.2
POW3  (via drill 0.35)
  Top 0.305: v55.63,15.11 55.37,15.37 55.37,16.13 55.35,16.15 U4.32 52.09,16.15 52.07,16.13 | U4.14 U4.15 63.38,20.95 63.12,21.21 63.12,22.23 v63.88,22.99 | 52.07,18.54 52.08,18.55 U4.29
  Top 0.813: 52.32,3.3 52.32,2.16 51.18,1.02 10.03,1.02 | J3.8 4.45,1.02 10.03,1.02 | R26.1 10.03,1.02 | C8.+ 52.32,3.3 | 52.32,3.3 52.32,7.24 52.07,7.49 52.07,16.13 52.07,18.54 52.07,20.19 | 52.07,20.19 52.07,20.83 | 52.07,20.83 52.07,24.26 C7.1 | U4.27 52.11,20.15 52.07,20.19 | U4.26 52.19,20.95 52.07,20.83
  Bottom 0.305: v63.88,22.99 58.04,22.99 56.64,21.59 56.64,16.13 v55.63,15.11
PWM1  (via drill 0.35)
  Top 0.203: v11.18,43.56 10.79,43.18 IC2.4
  Bottom 0.203: v11.18,43.56 14.48,46.86 19.94,46.86 22.35,49.28 28.45,49.28 IC1.5
PWM2
  Bottom 0.203: IC1.6 33.78,41.4 33.78,27.3 32.64,26.16 32.64,19.05 33.02,18.67 33.02,3.56 32,2.54 IC2.21
PWM3
  Top 0.203: IC1.20 45.85,48.26 46.86,47.24 60.45,47.24 J6.4
PWM4
  Top 0.203: J6.3 60.71,52.07 46.48,52.07 45.21,50.8 IC1.21
PWM5
  Top 0.203: IC1.22 44.95,53.59 56.26,53.59 57.28,52.58 60.71,52.58 J6.2
PWM6
  Top 0.203: IC1.23 57.15,55.88 57.91,55.12 60.71,55.12 J6.1
PWM_ERW1  (via drill 0.35)
  Top 0.203: IC1.2 26.29,55.88 v25.53,56.64
  Bottom 0.203: v25.53,56.64 23.11,59.05 23.11,64.26 22.61,64.77 J12.1
PWM_ERW2  (via drill 0.35)
  Top 0.203: IC1.3 27.43,53.34 v24.64,56.13
  Bottom 0.203: v24.64,56.13 22.48,58.29 22.48,61.59 21.84,62.23 J12.2
PWM_ERW3  (via drill 0.35)
  Top 0.203: v25.4,53.72 25.4,54.1 v23.37,56.13
  Bottom 0.203: v23.37,56.13 21.72,56.13 18.54,59.31 J12.3 | IC1.4 26.16,50.8 25.4,51.56 v25.4,53.72
RADL  (via drill 0.35)
  Top 0.203: IC1.24 27.43,25.4 27.33,25.5 v27.33,25.91
  Bottom 0.203: v27.33,25.91 27.33,27.54 26.92,27.94 J10.2
RADL1
  Top 0.203: J1.1 12.7,22.86 11.68,23.88 11.68,35.56 11.68,38.61 11.05,39.24 9.27,39.24 IC2.5
RADL2
  Top 0.203: J1.3 IC2.27
RADL_3V3
  Top 0.203: R19.1 R18.1 26.04,23.75 J10.1
RADL_5V
  Top 0.203: J1.2 19.05,21.34 24.13,21.34 R18.2
RADR
  Bottom 0.203: IC1.25 28.7,22.86 28.19,23.37 28.19,24.13 28.19,29.97 27.69,30.48 J11.2
RADR_3V3
  Top 0.203: R20.1 R21.1
  Bottom 0.203: J11.1 24.77,34.29 20.07,34.29 R21.1
RADR_5V  (via drill 0.35)
  Top 0.203: IC2.17 6.22,11.81 6.22,35.94 7.11,36.83 9.65,36.83 10.54,36.83 11.18,36.2 11.18,35.05 10.79,34.67 v10.41,34.67
  Bottom 0.203: R20.2 15.62,30.48 14.73,31.37 14.73,32.77 13.46,34.04 11.05,34.04 v10.41,34.67
RESET  (via drill 0.35)
  Top 0.203: 12.98,8.38 20.32,8.38 21.72,9.78 21.72,10.54 22.35,11.18 41.15,11.18 v42.16,12.19 | v6.22,8.64 9.4,8.64 9.65,8.38 12.19,8.38 12.98,8.38 | IC3.2 12.98,8.38 | J3.2 2.79,18.56 4.22,19.99 4.22,49.38 J13.2
  Bottom 0.203: v6.22,8.64 5.33,9.53 5.33,17.14 4.57,17.91 J3.2 | v42.16,12.19 IC1.R
ROSC  (via drill 0.35)
  Top 0.203: U4.9 65.15,15.64 v65.15,15.11
  Bottom 0.203: v65.15,15.11 65.53,15.49 65.53,24.13 65.15,24.51 R30.2
RX2
  Bottom 0.203: IC2.14 6.73,18.92 6.73,23.37 7.49,24.13 8.26,24.13 9.14,25.02 9.14,35.31 9.65,35.81 20.32,35.81 21.46,36.96 28.32,36.96 IC1.9
RX5
  Bottom 0.203: J7.3 46.48,5.08 44.7,6.86 IC1.34
SCHRANKE
  Top 0.203: R11.2 10.41,49.53 9.14,50.8 IC2.1
SCHRANKE_3V3
  Top 0.203: IC1.54 38.23,39.24 11.81,39.24 R12.1
  Bottom 0.203: R11.1 R12.1
SCK0  (via drill 0.35)
  Top 0.203: IC1.14 46.23,34.54 52.07,34.54 54.48,36.96 58.8,36.96 v59.56,37.72
  Bottom 0.203: v59.56,37.72 61.85,37.72 64.26,40.13 J8.3
SCK1
  Bottom 0.203: IC1.32 28.19,3.81 5.84,3.81 4.45,5.21 J3.7
SCL0  (via drill 0.35)
  Top 0.203: U3.S 12.89,11.62 v12.45,12.06 | v12.45,28.32 13.08,28.96 13.08,32.64 14.48,34.04 30.86,34.04 31.24,34.42 v31.24,35.69
  Bottom 0.203: v12.45,12.06 11.81,12.7 11.81,17.4 10.67,18.54 R2.1 9.53,20.07 9.53,22.99 10.29,23.75 10.29,27.69 11.05,28.45 12.32,28.45 v12.45,28.32 | v31.24,35.69 31.24,38.73 30.61,39.37 28.19,39.37 27.56,40.01 27.56,42.67 28.07,43.18 IC1.7
SCL0_5V  (via drill 0.35)
  Top 0.203: U3.D 10.41,10.67 v9.78,11.3
  Bottom 0.203: J2.4 4.95,24.13 5.97,23.11 5.97,14.48 6.48,13.97 8.64,13.97 9.65,14.99 | 9.65,14.99 9.65,16 10.41,16.76 R4.1 | v9.78,11.3 9.65,11.43 9.65,14.99
SCL3
  Top 0.203: IC1.57 40.64,49.28 60.45,49.28 60.96,49.78 65.02,49.78 65.79,50.55 65.79,55.75 65.41,56.13 J5.4
SDA0  (via drill 0.35)
  Top 0.203: R1.1 11.94,13.34 17.02,13.34 17.27,13.59 17.27,13.97 18.37,15.07 U2.S 20.64,15.3 21.84,16.51 23.5,16.51 25.91,18.92 30.48,18.92 v30.86,19.3
  Bottom 0.203: IC1.8 32.64,40.64 33.27,40.01 33.27,28.57 31.62,26.92 31.62,20.07 v30.86,19.3
SDA0_5V  (via drill 0.35)
  Top 0.203: U2.D 16.17,17.1 15.49,17.78 12.7,17.78 11.94,18.54 11.94,20.07 10.79,21.21 | v8.38,26.67 8.64,26.67 9.91,25.4 9.91,23.5 10.67,22.73 10.67,21.34 10.79,21.21 | 10.79,21.21 R3.1
  Bottom 0.203: v8.38,26.67 J2.3
SDA3  (via drill 0.35)
  Top 0.203: IC1.56 42.04,45.72 43.18,46.86 53.47,46.86 53.83,46.5 v53.85,46.5 | J5.3 63.25,54.61 v54.1,54.61
  Bottom 0.203: v54.1,54.61 53.85,54.36 v53.85,46.5
SDIO_5V  (via drill 0.35)
  Top 0.203: U1.D 14.35,28.15 14.35,31.37 v13.97,31.75 | R25.2 9.65,33.02 7.87,34.8 IC2.7
  Bottom 0.203: R25.2 11.3,33.02 12.57,31.75 v13.97,31.75
SERVO2_FB
  Top 0.203: IC1.49 40.77,13.84 50.16,13.84 J4.3
SERVO3_FB
  Top 0.203: IC1.50 43.05,15.24 44.07,14.22 48.01,14.22 J4.2
SWCLK  (via drill 0.35)
  Top 0.203: v8.76,44.32 12.19,44.32 13.4,43.12 14.35,42.16 30.35,42.16 31.37,43.18 IC1.DC
  Bottom 0.203: J13.5 3.94,44.32 v8.76,44.32
SWD_EN  (via drill 0.35)
  Top 0.203: v7.62,46.99 11.18,46.99 12.95,45.21 14.1,45.21 v14.22,45.09
  Bottom 0.203: IC1.DE 32.13,45.72 30.73,47.12 22.35,47.12 19.94,44.7 14.61,44.7 v14.22,45.09 | v7.62,46.99 6.35,45.72 J13.4
SWDIO  (via drill 0.35)
  Top 0.203: IC1.DD 36.07,39.62 12.45,39.62 11.81,40.26 11.81,40.89 11.05,41.66 7.11,41.66 v7.11,41.78
  Bottom 0.203: v7.11,41.78 3.94,41.78 J13.6
TX2
  Bottom 0.203: IC2.15 8,15.24 8.89,16.13 8.89,24 9.65,24.77 9.65,30.08 9.63,30.1 9.63,30.12 9.53,30.23 9.53,34.92 9.91,35.31 20.45,35.31 21.72,36.58 26.54,36.58 27.56,35.56 IC1.10
TX5
  Bottom 0.203: J7.4 46.48,2.54 44.7,4.32 IC1.33
VBYP
  Top 0.203: U4.11 65.82,17.75 66.42,17.14 66.42,11.94 C11.1
VCLAMP
  Top 0.203: U4.13 66.09,19.35 66.42,19.68 66.42,25.15 65.79,25.78 63.37,25.78 C9.1
VREG
  Top 0.203: U4.10 65.73,16.95 66.04,16.64 66.04,14.48 63.88,12.32 | 63.88,12.32 63.75,12.19 61.84,12.19 61.59,12.45 U4.7 | C10.1 58.17,10.54 J16.1 | 63.88,12.32 62.1,10.54 J17.1
  Bottom 0.203: J16.1 J17.1

### Text on the board
Top: Teensy Adapter / Board v2.0 | (c) Timo Sandmann | CC BY-SA 10/2018
tNames: 3V3 | T | VOL | PWM | BPS | SCL | SDA | 3V3 | 3V3 | T | PWM | T | T | SWD | I2C3 | CS | SCK | MISO | SPI0 | MOSI | T | 5V | SDA | SPK | I2C0 | U1 | SCL | dflt | T | RADL | RST | 5V | CS | ANALOG | MOSI | U2 | SPI1 | T | MISO | U3 | 3V3 | SCK | RX | POW3 | TX | TEENSY 3.6 | gain / select | UART5
bNames: DD | DC | KL02 SWD